# EAGLE design light_board (EAGLE 9.6.2)
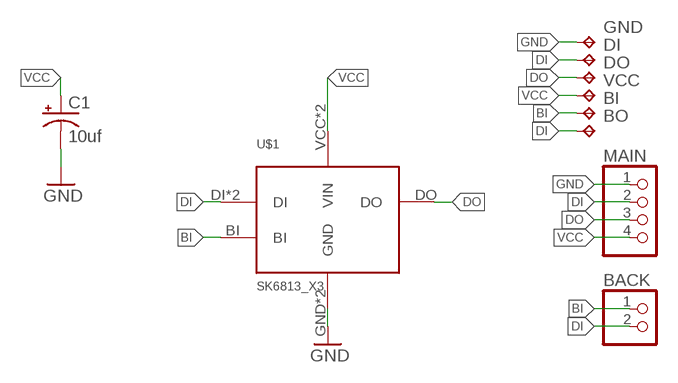
[diagram p0: schematic, sheet 1]

## Parts
BACK  PINHD-1X2  [1X02]
BI  TPB1,27  [B1,27]
BO  TPB1,27  [B1,27]
C1  10uf  CPOL-US153CLV-0405  [153CLV-0405]
DI  TPB1,27  [B1,27]
DO  TPB1,27  [B1,27]
GND  TPB1,27  [B1,27]
MAIN  PINHD-1X4  [1X04]
U$1  SK6813_X3  [SK6813_X3]
VCC  TPB1,27  [B1,27]

## Nets
BI: BACK.1 BI.TP U$1.BI
DI: BACK.2 BO.TP DI.TP MAIN.2 U$1.DI U$1.DI@1(DI)
DO: DO.TP MAIN.3 U$1.DO
GND: C1.- GND.TP MAIN.1 U$1.GND U$1.GND@1(GND)
VCC: C1.+ MAIN.4 U$1.VCC(VIN) U$1.VCC@1(VIN) VCC.TP

## Library data of the parts
BACK = pinhead:PINHD-1X2: PIN HEADER
BI BO DI DO GND VCC = testpad:TP: Test pad
C1 = rcl:CPOL-US: POLARIZED CAPACITOR, American symbol; SPICEPREFIX: C
MAIN = pinhead:PINHD-1X4: PIN HEADER
U$1 = CustomParts:SK6813_X3

## Board
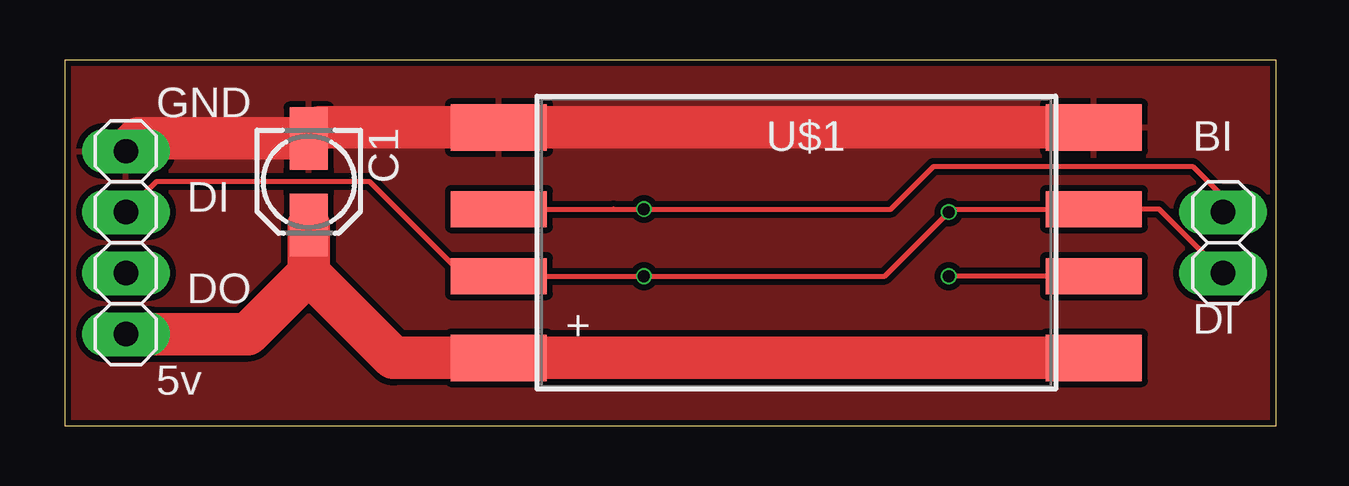
[diagram p1: board, top side]
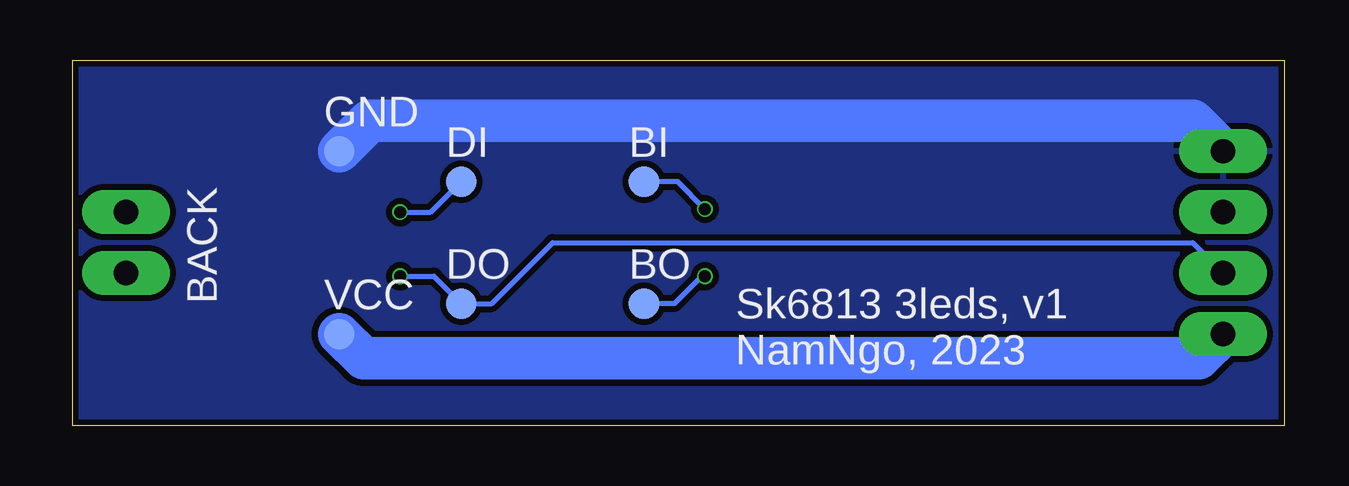
[diagram p2: board, bottom side, seen from below]

Size 50.47 x 15.23 mm. Coordinates in mm from the lower left corner, seen from the top.
Outline: 0,0 50.47,0 50.47,15.23 0,15.23 0,0
Copper layers (1*16): Top 0.035mm / dielectric 1.6mm / Bottom 0.035mm
Design rules "jlcpcb-2layers": minimum track width 5mil, minimum drill 0.3mm, track to track 5mil, track to pad 5mil, pad to pad 5mil, via to via 5mil, smd to smd 5mil, copper to edge 0.2mm, drill to drill 6mil, minimum pad ring 10mil, minimum via ring 3mil, stop-mask expansion 4mil, vias tented up to drill 0mil, thermal gap 10mil

### Footprints (pad centres in the part's own frame; a part is rotated, then mirrored left to right if it is on the bottom)
1X02 = drill 1.016 long: 1 -1.27,0; 2 1.27,0
B1,27 = smd 1.27 x 1.27: TP 0,0
153CLV-0405 = smd 2.6 x 1.6: + 1.8,0; - -1.8,0
1X04 = drill 1.016 long: 1 -3.81,0; 2 -1.27,0; 3 1.27,0; 4 3.81,0
SK6813_X3 = smd 4 x 1.5: BI -12.4,1.4; DI -12.4,-1.4; DI@1 12.4,1.4; DO 12.4,-1.4 | smd 4 x 1.93: GND -12.4,4.8; GND@1 12.4,4.8; VCC -12.4,-4.8; VCC@1 12.4,-4.8

### Placement (x,y rotation side)
BACK  48.26,7.62 270 top
BI  26.67,10.16 0 bottom
BO  26.67,5.08 0 bottom
C1  10.16,10.16 270 top
DI  34.29,10.16 0 bottom
DO  34.29,5.08 0 bottom
GND  39.37,11.43 0 bottom
MAIN  2.54,7.62 270 top
U$1  30.48,7.62 0 top
VCC  39.37,3.81 0 bottom

### Tracks (layer width: path | path; a pad name or v marks a point on that pad's centre or on a via)
BI  (via drill 0.5)
  Top 0.203: BACK.1 48.26,9.52 46.99,10.79 36.2,10.79 34.42,9.02 v24.13,9.02 22.86,9.02 U$1.BI
  Bottom 0.203: v24.13,9.02 25.27,10.16 BI.TP
DI  (via drill 0.5)
  Top 0.203: MAIN.2 3.81,10.16 12.7,10.16 16.64,6.22 U$1.DI v24.13,6.22 34.16,6.22 v36.83,8.89 36.96,9.02 U$1.DI@1 45.59,9.02 BACK.2
  Bottom 0.203: v24.13,6.22 24.26,6.22 25.4,5.08 BO.TP | v36.83,8.89 35.56,8.89 DI.TP
DO  (via drill 0.5)
  Top 0.203: U$1.DO v36.83,6.22
  Bottom 0.203: MAIN.3 3.81,7.62 30.48,7.62 33.02,5.08 DO.TP 35.43,6.22 v36.83,6.22
GND
  Top 1.778: MAIN.1 3.07,11.96 C1.- 10.62,12.42 U$1.GND U$1.GND@1
  Bottom 1.778: GND.TP 38.1,12.7 3.81,12.7 MAIN.1
  pour Bottom (isolate 0.254): 0,15.24 50.8,15.24 50.8,0 0,0
  pour Top (isolate 0.254): 0,15.24 50.8,15.24 50.8,0 0,0
VCC
  Top 1.778: 10.16,6.35 13.69,2.82 U$1.VCC U$1.VCC@1 | 10.16,6.35 C1.+ | MAIN.4 7.62,3.81 10.16,6.35
  Bottom 1.778: VCC.TP 38.35,2.79 3.56,2.79 MAIN.4

### Text on the board
tPlace: GND | BI | DI | DO | DI | 5v
bNames: Sk6813 3leds, v1 / NamNgo, 2023